# Altium schematic sheet 01 Cover.SchDoc
size A3
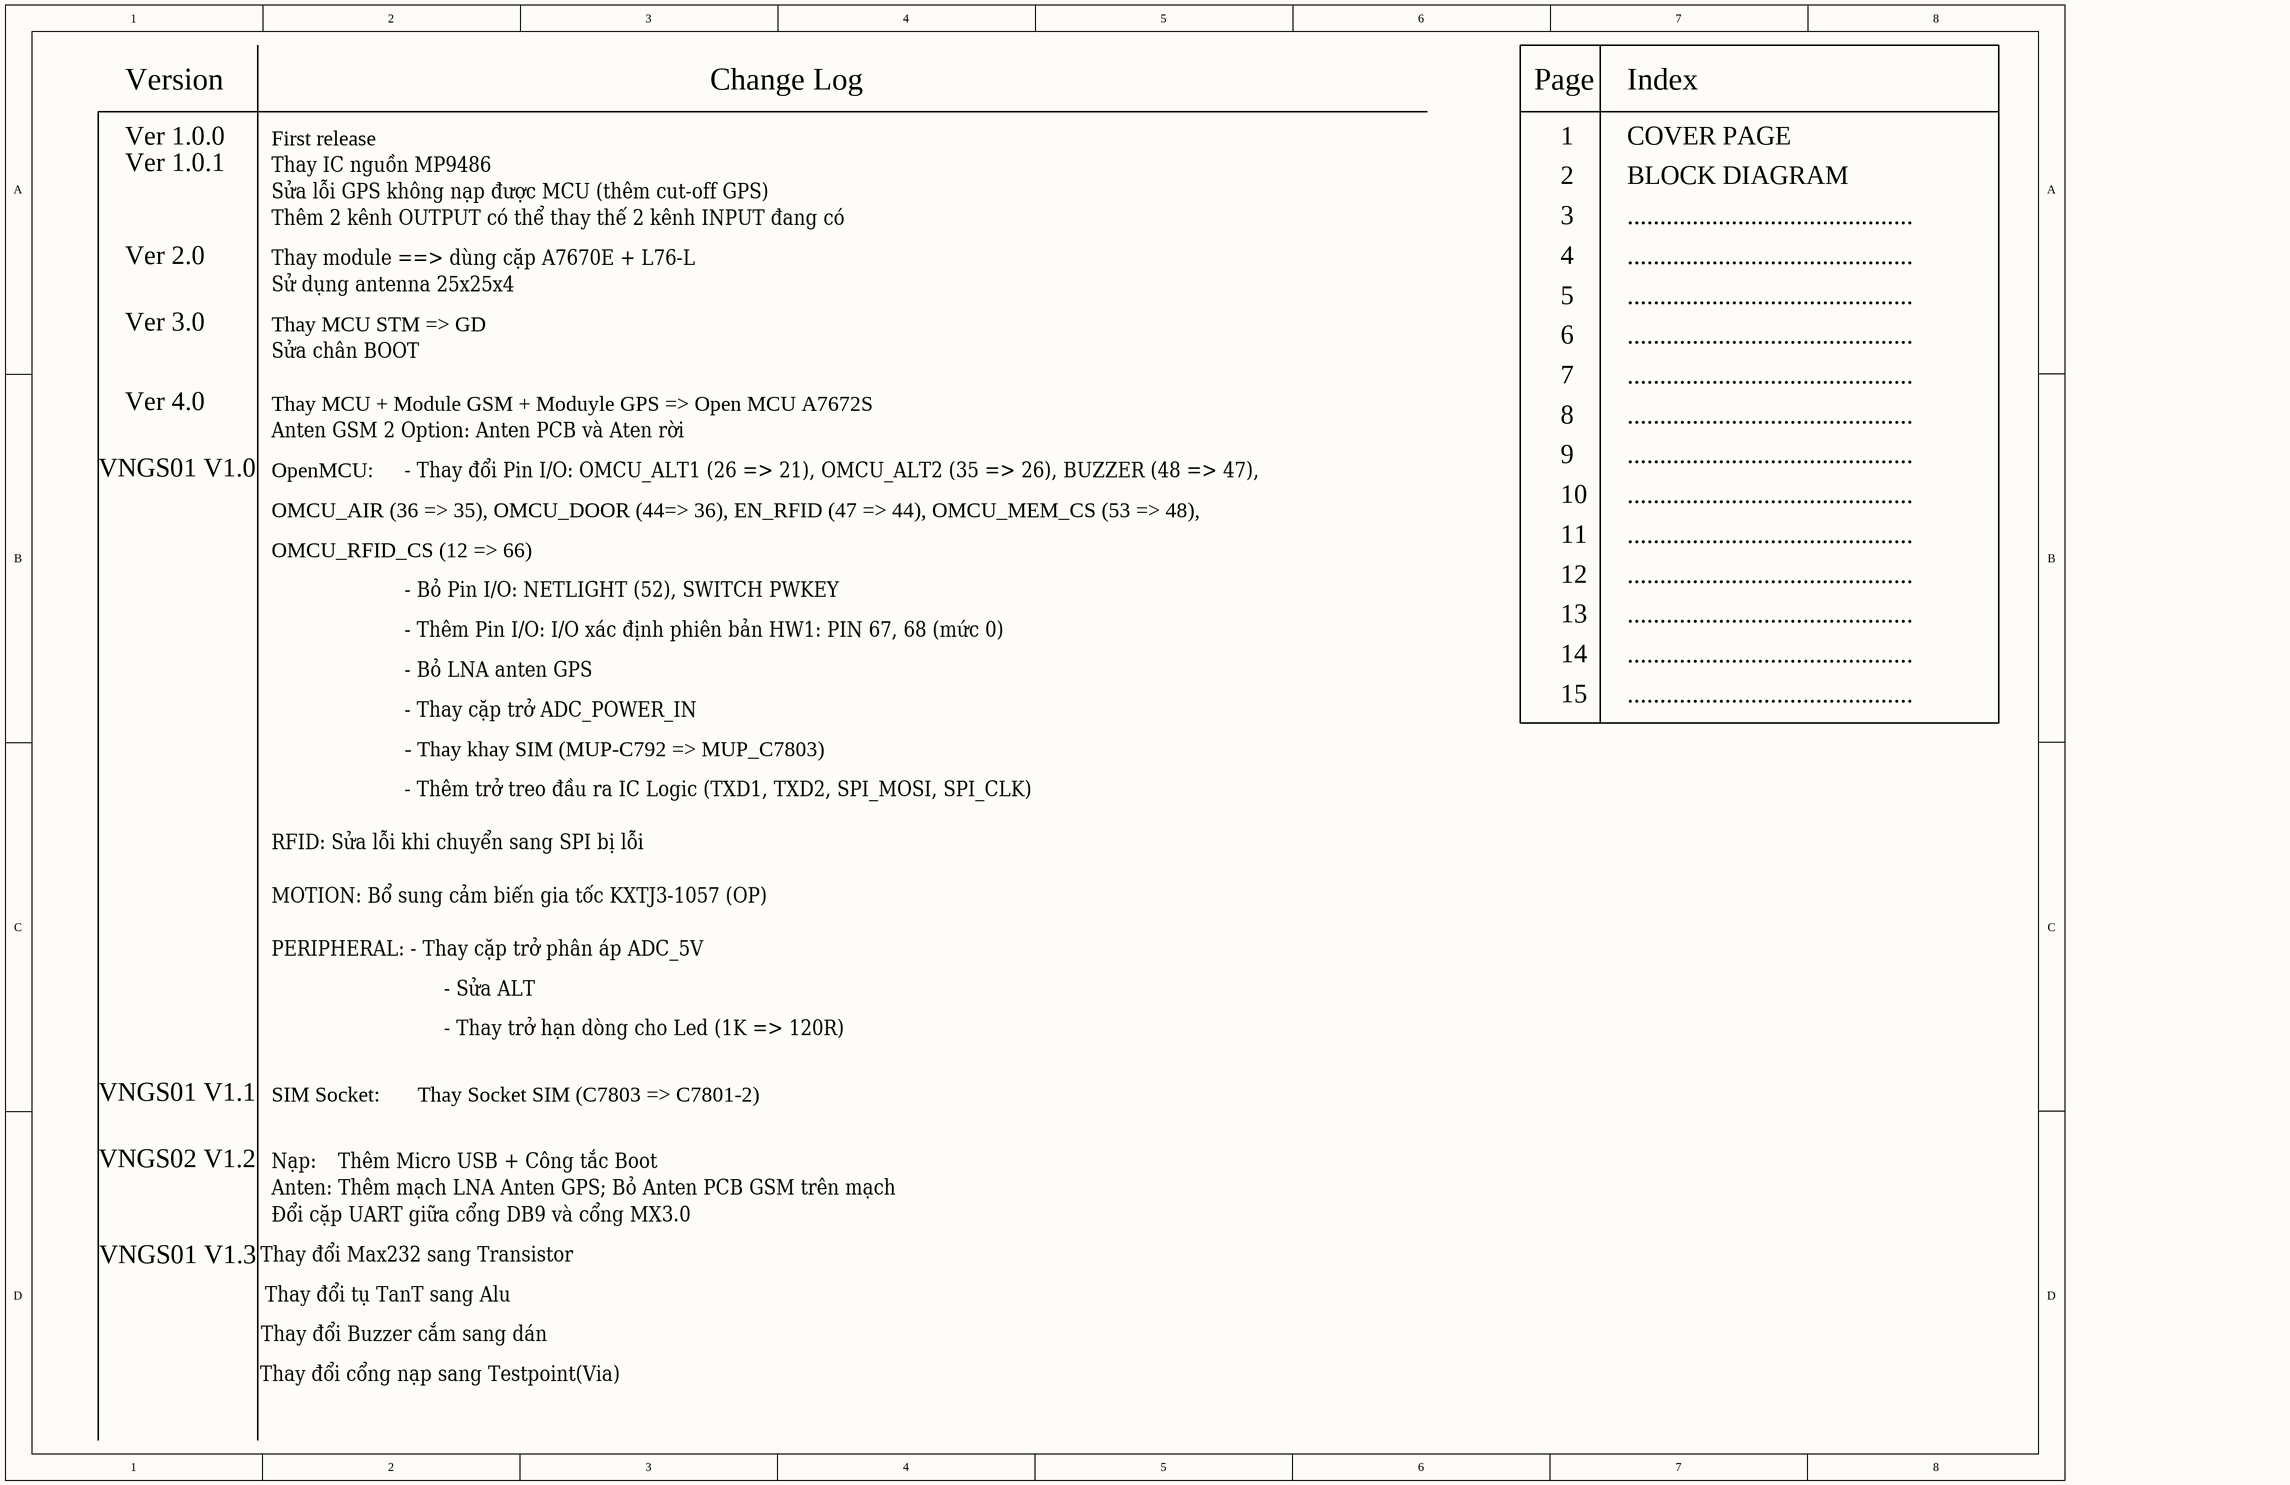
[diagram p0: 01 Cover.SchDoc]

## Notes on the sheet
- Version
- Change Log
- Page
- Index
- Ver 1.0.0
- Ver 1.0.1
- First release
- Thay IC nguồn MP9486
- 1
- COVER PAGE
- Sửa lỗi GPS không nạp được MCU (thêm cut-off GPS)
- Thêm 2 kênh OUTPUT có thể thay thế 2 kênh INPUT đang có
- 2
- 3
- BLOCK DIAGRAM
- ............................................
- Ver 2.0
- Thay module ==> dùng cặp A7670E + L76-L
- Sử dụng antenna 25x25x4
- 4
- 5
- Ver 3.0
- Thay MCU STM => GD
- Sửa chân BOOT
- 6
- Ver 4.0
- Thay MCU + Module GSM + Moduyle GPS => Open MCU A7672S
- Anten GSM 2 Option: Anten PCB và Aten rời
- 7
- 8
- VNGS01 V1.0
- OpenMCU:
- - Thay đổi Pin I/O: OMCU_ALT1 (26 => 21), OMCU_ALT2 (35 => 26), BUZZER (48 => 47),
- 9
- 10
- OMCU_AIR (36 => 35), OMCU_DOOR (44=> 36), EN_RFID (47 => 44), OMCU_MEM_CS (53 => 48),
- OMCU_RFID_CS (12 => 66)
- 11
- - Bỏ Pin I/O: NETLIGHT (52), SWITCH PWKEY
- - Thêm Pin I/O: I/O xác định phiên bản HW1: PIN 67, 68 (mức 0)
- 12
- 13
- - Bỏ LNA anten GPS
- 14
- 15
- - Thay cặp trở ADC_POWER_IN
- - Thay khay SIM (MUP-C792 => MUP_C7803)
- - Thêm trở treo đầu ra IC Logic (TXD1, TXD2, SPI_MOSI, SPI_CLK)
- RFID: Sửa lỗi khi chuyển sang SPI bị lỗi
- MOTION: Bổ sung cảm biến gia tốc KXTJ3-1057 (OP)
- PERIPHERAL: - Thay cặp trở phân áp ADC_5V
- - Sửa ALT
- - Thay trở hạn dòng cho Led (1K => 120R)
- VNGS01 V1.1
- SIM Socket:
- Thay Socket SIM (C7803 => C7801-2)
- VNGS02 V1.2
- Nạp:
- Thêm Micro USB + Công tắc Boot
- Anten: Thêm mạch LNA Anten GPS; Bỏ Anten PCB GSM trên mạch
- Đổi cặp UART giữa cổng DB9 và cổng MX3.0
- VNGS01 V1.3
- Thay đổi tụ TanT sang Alu
- Thay đổi Max232 sang Transistor
- Thay đổi Buzzer cắm sang dán
- Thay đổi cổng nạp sang Testpoint(Via)